# EasyEDA Pro project Striso_audio_mixer.epro

# Schematic audio switch
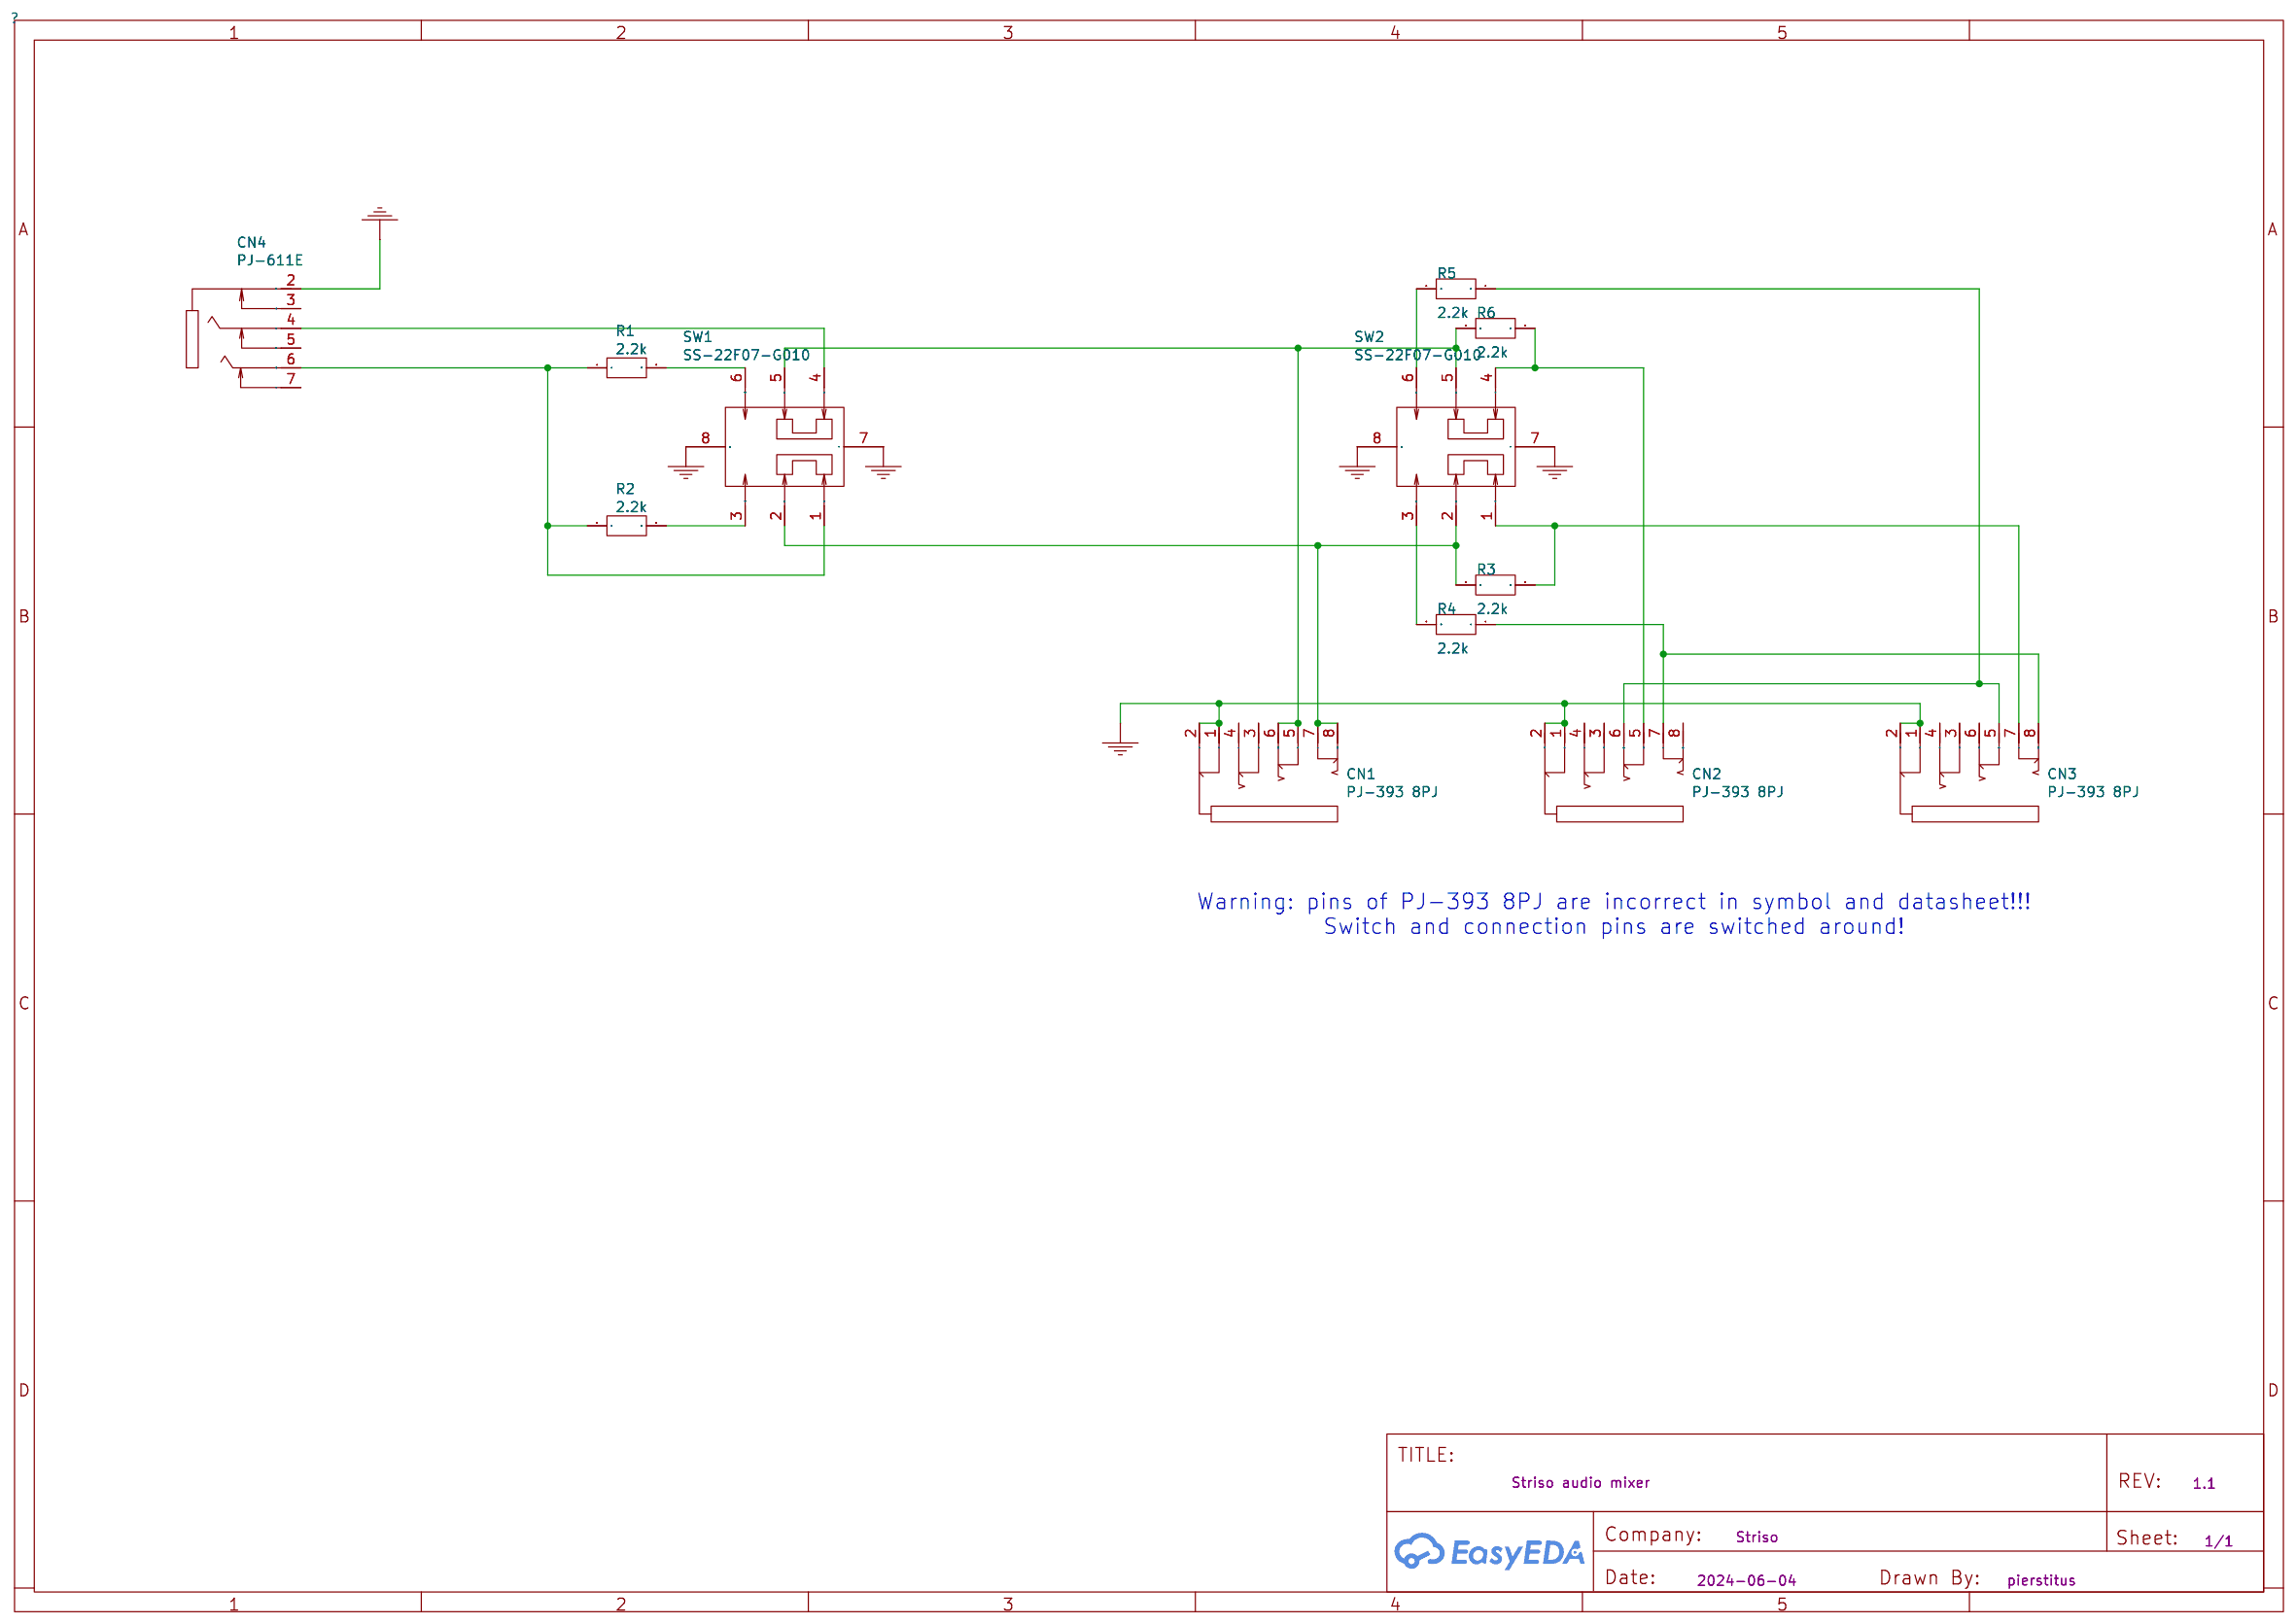
[diagram p0: schematic sheet]

## Parts
CN1  PJ-393 8PJ  [AUDIO-SMD_PJ-393-8PJ]
CN2  PJ-393 8PJ  [AUDIO-SMD_PJ-393-8PJ]
CN3  PJ-393 8PJ  [AUDIO-SMD_PJ-393-8PJ]
CN4  PJ-611E  [AUDIO-TH_PJ-611E]
R1  2.2k  [R0603]
R2  2.2k  [R0603]
R3  2.2k  [R0603]
R4  2.2k  [R0603]
R5  2.2k  [R0603]
R6  2.2k  [R0603]
SW1  SS-22F07-G010  [SW-TH_6P-L16.5-W7.5-P4.0-LS2.6-TL]
SW2  SS-22F07-G010  [SW-TH_6P-L16.5-W7.5-P4.0-LS2.6-TL]

## Library data of the parts
CN1-CN3 = PJ-393 8PJ: Supplier: LCSC; Supplier Part: C668609; Manufacturer: SHOU HAN(首韩); JLCPCB Part Class: Extended Part
CN4 = PJ-611E: Supplier: LCSC; Supplier Part: C309282; Manufacturer: HOOYA(皓宇电子); JLCPCB Part Class: Extended Part
R1-R6 = 2.2k
SW1 SW2 = SS-22F07-G010: Supplier: LCSC; Supplier Part: C2848924; Manufacturer: G-Switch(品赞); JLCPCB Part Class: Extended Part

## Nets
GND: CN1.1 CN1.2 CN2.1 CN2.2 CN3.1 CN3.2 CN4.2 SW1.7 SW1.8 SW2.7 SW2.8
$1N1: CN2.7 CN3.8 R4.1
$1N2: CN2.6 CN3.5 R5.1
$1N3: CN3.7 R3.1 SW2.1
$1N8: CN4.6 R1.1 R2.1 SW1.1
$1N10: R1.2 SW1.6
$1N11: R2.2 SW1.3
$1N12: CN4.4 SW1.4
$1N18: R5.2 SW2.6
$1N577: CN1.7 CN1.8 R3.2 SW1.2 SW2.2
$1N586: R4.2 SW2.3
$1N596: CN2.5 R6.1 SW2.4
$1N605: CN1.5 CN1.6 R6.2 SW1.5 SW2.5

Not connected (* = marked no-connect by the designer): CN1 3 4; CN2 3 4 8; CN3 3 4 6; CN4 3 5 7

## Notes on the sheet
- Warning: pins of PJ-393 8PJ are incorrect in symbol and datasheet!!!
  Switch and connection pins are switched around!

# Board PCB_audio switch
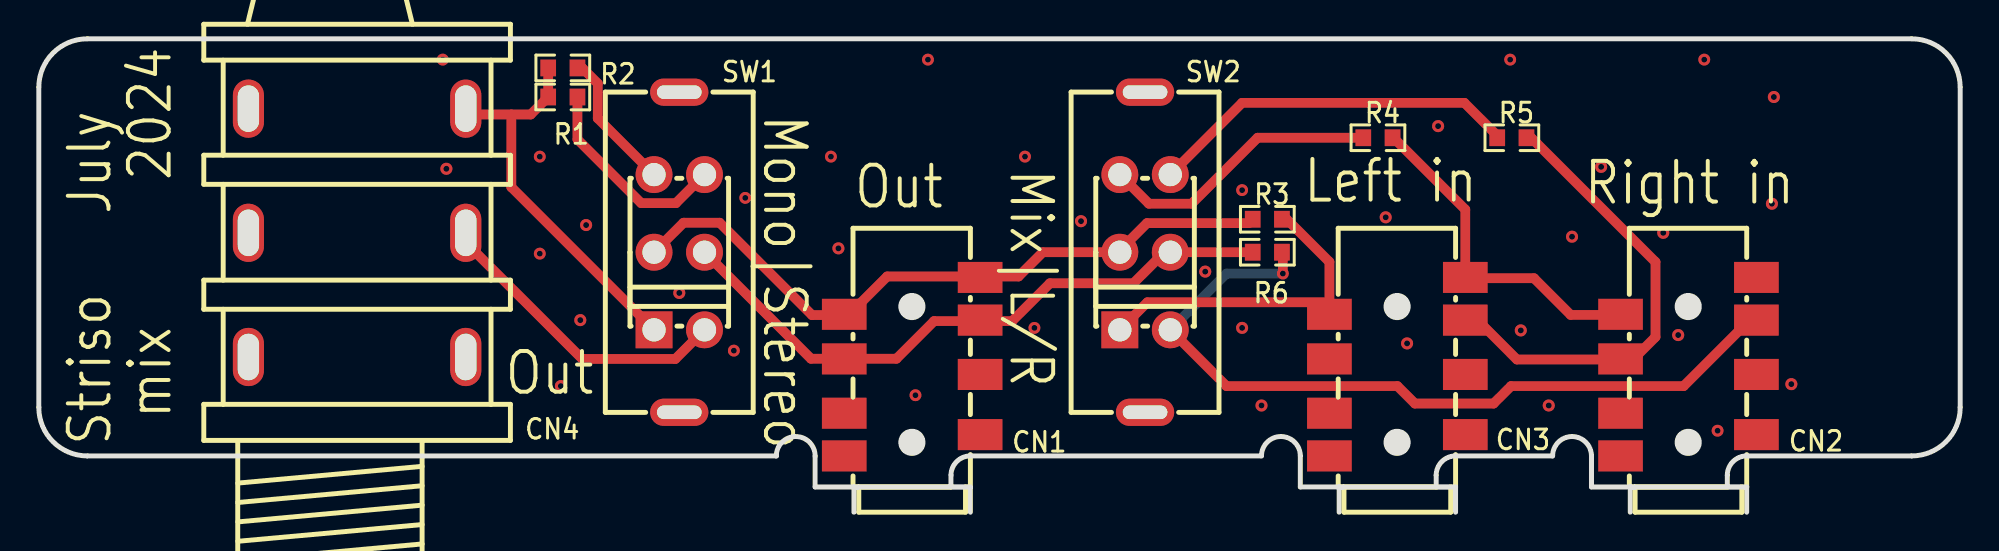
[diagram p1: board, top side]
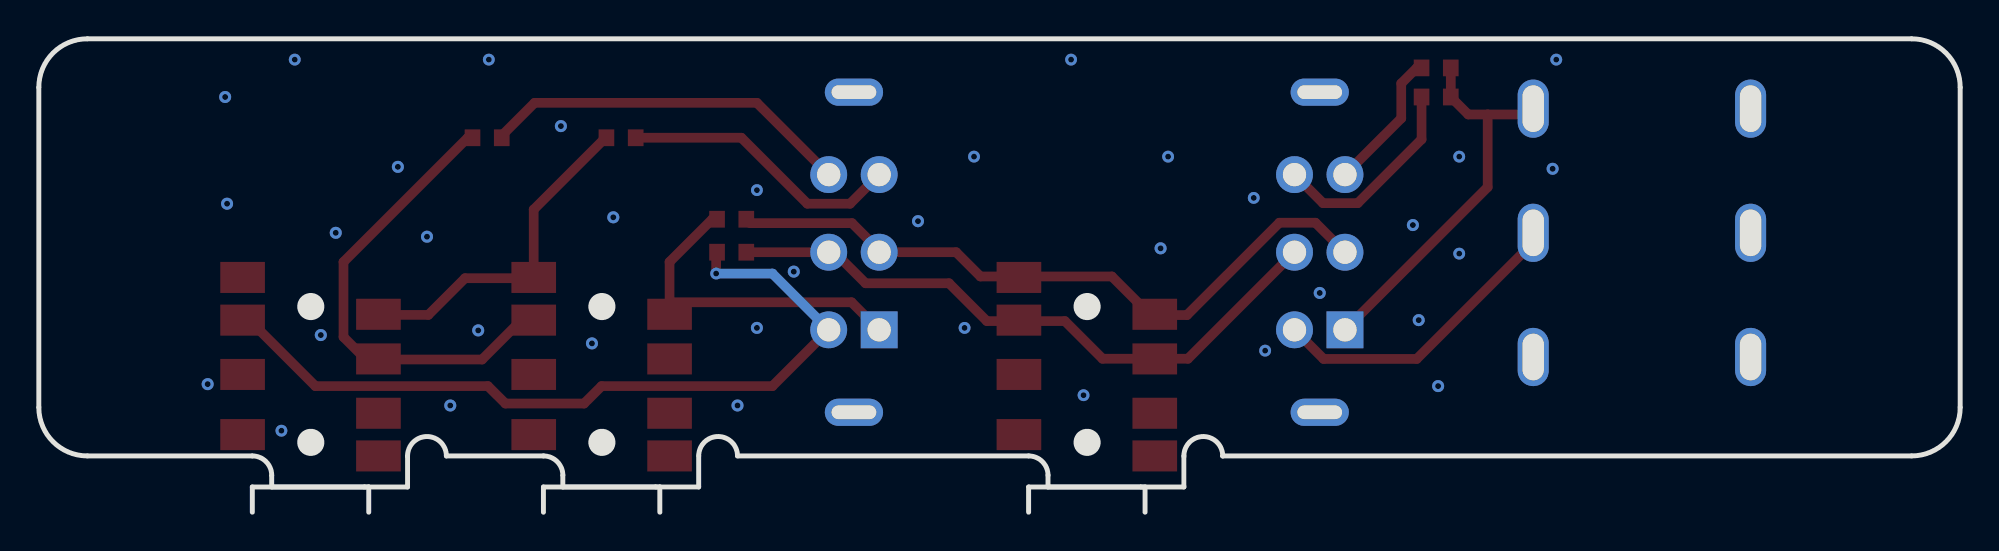
[diagram p2: board, bottom side, seen from below]

Outline 99 x 24.4 mm; copper layers: Top Layer, Bottom Layer. Coordinates in mm from the lower left corner of the outline.
Outline path: 0,21.9 0,5.4 arc(0.73,3.63) 2.5,2.9 38,2.9 arc(39,3.9) 40,2.9 40,1.3 47,1.3 47,1.9 arc(47.29,2.61) 48,2.9 63,2.9 arc(64,3.9) 65,2.9 65,1.3 72,1.3 72,1.9 arc(72.29,2.61) 73,2.9 78,2.9 arc(79,3.9) 80,2.9 80,1.3 87,1.3 87,1.9 arc(87.29,2.61) 88,2.9 96.5,2.9 arc(98.27,3.63) 99,5.4 99,21.9 arc(98.27,23.67) 96.5,24.4 2.5,24.4 arc(0.73,23.67) 0,21.9
Stack: Top Layer 0.035mm / Dielectric1 1.51mm FR4 er 4.5 / Bottom Layer 0.035mm

## Design rules (mm)
spacing Default (default): track to track 0.152, other pairs 0 to 0.152
track width Default (default): min 0.5, default 0.5, max 25.4
differential pair differentialPair (default): width min 0.127, default 0.254, max 2.54; gap min 0.152, default 0.152
via Default (default): diameter min 0.61, default 0.61, max 100.025; hole min 0.305, default 0.305, max 59.995
net GND uses gge6406(1)
pour e1 uses gge6406
pour e85 uses gge6406(1)

## Placement (name value [footprint] x y rotation side)
CN1  PJ-393 8PJ  [AUDIO-SMD_PJ-393-8PJ]  45 7.5 180 top
CN2  PJ-393 8PJ  [AUDIO-SMD_PJ-393-8PJ]  85 7.5 180 top
CN3  PJ-393 8PJ  [AUDIO-SMD_PJ-393-8PJ]  70 7.5 180 top
CN4  PJ-611E  [AUDIO-TH_PJ-611E]  16.4 14.4 270 top
R1  2.2k  [R0603]  27 21.4 0 top
R2  2.2k  [R0603]  27 22.9 0 top
R3  2.2k  [R0603]  63.3 15.1 180 top
R4  2.2k  [R0603]  69 19.3 180 top
R5  2.2k  [R0603]  75.9 19.3 180 top
R6  2.2k  [R0603]  63.3 13.4 180 top
SW1  SS-22F07-G010  [SW-TH_6P-L16.5-W7.5-P4.0-LS2.6-TL]  33 13.4 90 top
SW2  SS-22F07-G010  [SW-TH_6P-L16.5-W7.5-P4.0-LS2.6-TL]  57 13.4 90 top

## Footprints (pads in the part's own frame, mm; a bottom-side part is the same pattern mirrored in y, then rotated)
AUDIO-SMD_PJ-393-8PJ
  rect 2.3x1.6 smd: 1(-3.5,3.5) 2(3.5,4.6) 3(-3.5,0.4) 4(3.5,2.4) 5(-3.5,-2.4) 6(3.5,-0.4) 7(3.5,-2.7) 8(-3.5,-4.6)
AUDIO-TH_PJ-611E
  oval 3x1.6 hole 2.4x1.1: 2(6.4,5.6) 3(6.4,-5.6) 4(0,5.6) 5(0,-5.6) 6(-6.4,5.6) 7(-6.4,-5.6)
R0603
  rect 0.806x0.864 smd: 1(-0.753,0) 2(0.753,0)
SW-TH_6P-L16.5-W7.5-P4.0-LS2.6-TL
  rect 1.9x1.9 hole 1.2: 1(-4,1.3)
  round 1.9 hole 1.2: 2(0,1.3) 3(4,1.3) 4(-4,-1.3) 5(0,-1.3) 6(4,-1.3)
  oval 1.4x3 hole 0.7x2.3: 7(-8.25,0) 8(8.25,0)

## Nets
As in the schematic.

Pads without a net: CN1 3 4; CN2 3 4 8; CN3 3 4 6; CN4 3 5 7

## Via types
v1: diameter 0.62, hole 0.31, Top Layer to Bottom Layer, 22 vias
v2: diameter 0.61, hole 0.305, Top Layer to Bottom Layer, 15 vias

## Routing (per net, layer and track width the routed paths; a pad name or vN(x,y) marks a point on that pad's centre or on a via; arc(x,y) is an arc through that point)
GND:
  vias: v1(21,17.7) v1(26.9,6.5) v1(27.9,9.9) v1(28.2,14.8) v1(33,11.3) v1(41.2,13.6) v1(53.7,15) v1(60.1,12.4) v1(62,9.5) v1(63,5.5) v1(69.4,15.2) v1(70.5,8.7) v1(72.1,19.9) v1(76.36,9.37) v1(77.8,5.5) v1(79,14.2) v1(80.5,17.8) v1(83.7,14.4) v1(84.47,9.13) v1(89.3,15.9) v1(89.4,21.4) v1(90.3,6.6) v2(20.81,23.33) v2(25.81,18.33) v2(25.81,13.33) v2(35.81,8.33) v2(36.4,16.2) v2(40.81,18.33) v2(45.17,6.03) v2(45.81,23.33) v2(50.81,18.33) v2(51.3,9.5) v2(62,16.6) v2(75.81,23.33) v2(85.81,23.33) v2(86.5,4.2)
$1N1: length 17.6
  Top Layer w0.5: CN2.7 81.47,10.17 78.93,10.17 77.04,12.06 73.5,12.06 73.5,15.6 69.75,19.35
$1N2: length 24.3
  Top Layer w0.5: 76.65,19.3 76.9,19.3 83.3,12.9 83.3,9.03 82.14,7.87 76.16,7.87 74.13,9.9 CN3.5
$1N3: length 16.8
  Top Layer w0.5: SW2.1 57.12,10.82 66.5,10.82 66.5,12.9 64.3,15.1 64.05,15.1
$1N8: length 20.5
  Top Layer w0.5: 22,20 22.5,20.5 24.35,20.5 ; 24.35,20.5 24.35,16.75 SW1.1 ; 24.35,20.5 25.35,20.5 R1.1 R2.1
$1N10: length 10.7
  Top Layer w0.5: 34.3,17.4 32.83,15.93 31.04,15.93 27.75,19.22 R1.2
$1N11: length 7.3
  Top Layer w0.5: SW1.3 28.8,20.3 28.8,22.1 28,22.9 R2.2
$1N12: length 15.3
  Top Layer w0.5: SW1.4 32.8,7.9 28,7.9 22.3,13.6 22,13.6
$1N18: length 19.2
  Top Layer w0.5: SW2.6 62,21.1 73.45,21.1 75.15,19.41 R5.2
$1N577: length 35.6
  Top Layer w0.5: SW1.2 33.22,14.92 35.08,14.92 39.84,10.16 41.72,10.16 43.71,12.15 50.48,12.15 51.73,13.4 SW2.2 55.7,13.5 57.1,14.9 62.35,14.9 R3.2
$1N586: length 14.6
  Top Layer w0.5: SW2.3 57.2,15.9 59.4,15.9 62.8,19.3 R4.2
$1N596: length 42.2
  Top Layer w0.5: CN2.5 88.15,9.9 84.75,6.5 75.86,6.5 74.96,5.6 70.91,5.6 70,6.5 61.2,6.5 58.7,9 ; 58.7,9 SW2.4 58.7,9 ; v2(64.1,12.3) 64.1,13.35 64.05,13.4
  Bottom Layer w0.5: v2(64.1,12.3) 61.2,12.3 SW2.4
$1N605: length 32.8
  Top Layer w0.5: SW1.5 39.79,7.91 44.19,7.91 46.13,9.85 50.15,9.85 52.1,11.8 56.4,11.8 58,13.4 SW2.5 R6.2

## Copper pours and planes (outline as drawn; the poured copper is in the pictures)
GND on Top Layer: 20,24.4 91,24.4 91,1.3 20,1.3
GND on Bottom Layer: 20,24.4 91,24.4 91,1.3 20,1.3

## Text on the board
Top Silkscreen Layer: Out | Left in | Right in | Striso   July | 2024 | mix | Mono|Stereo | Mix|L/R
